# EAGLE schematic BSK5 (EAGLE 9.4.2)
ESKD_DESCRIPTION1: 207|235|224|242|224|32|193|209|202|53; ESKD_DESCRIPTION2: 241|245|229|236|224|32|253|235|229|234|242|240|232|247|229|241|234|224|255; ESKD_DESCRIPTION3: 239|240|232|237|246|232|239|232|224|235|252|237|224|255; ESKD_NUMBER: 67|67|83|50|46|50|54|48|48|45|48|221|51; ESKD_NUMBER_SHEET: 49; ESKD_SHEETS: 49
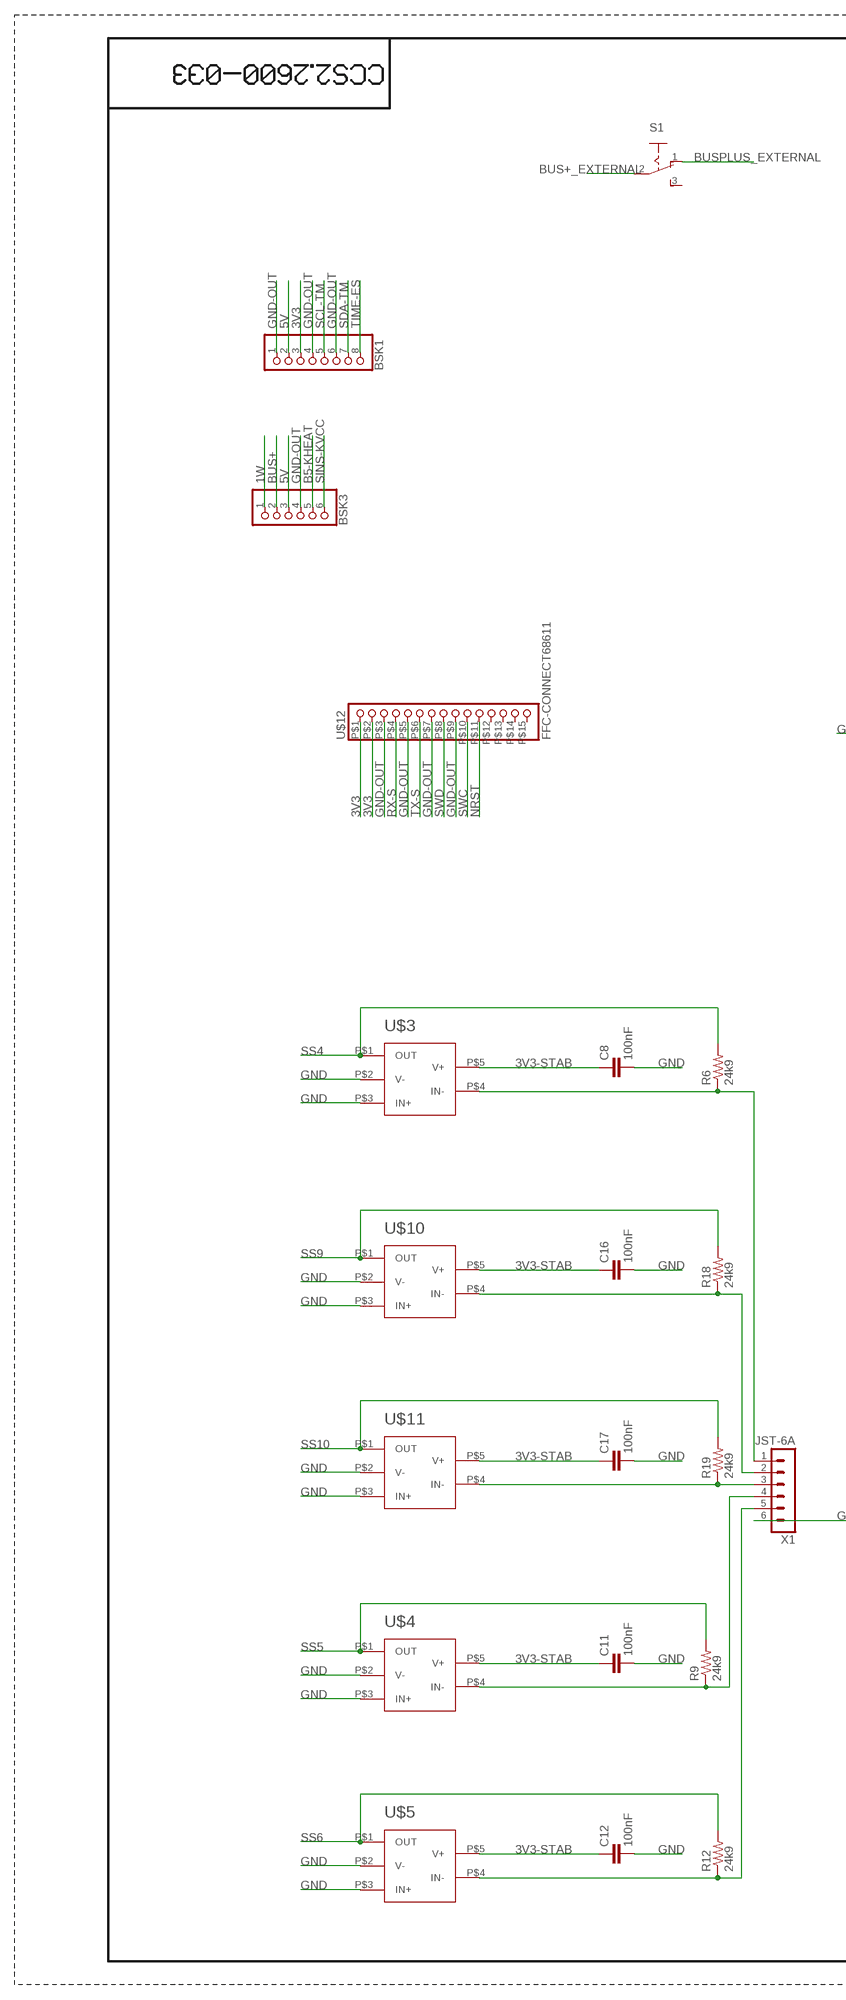
[diagram p0: schematic, sheet 1, part 1 of 3]
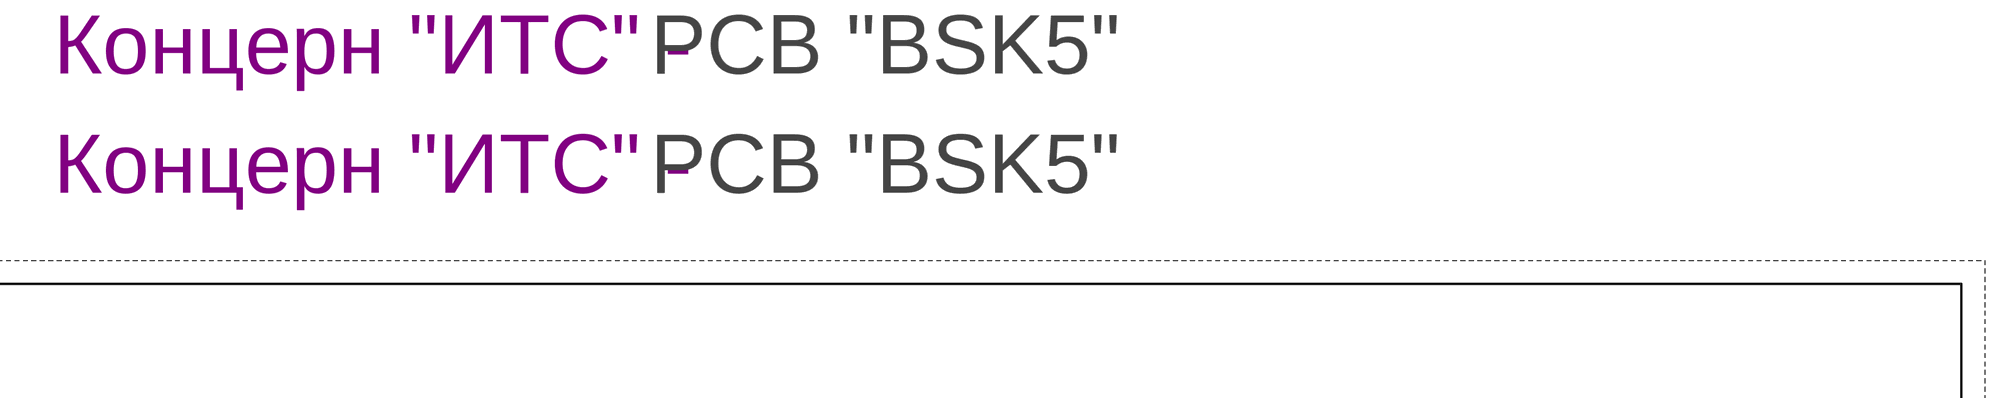
[diagram p1: schematic, sheet 1, part 2 of 3]
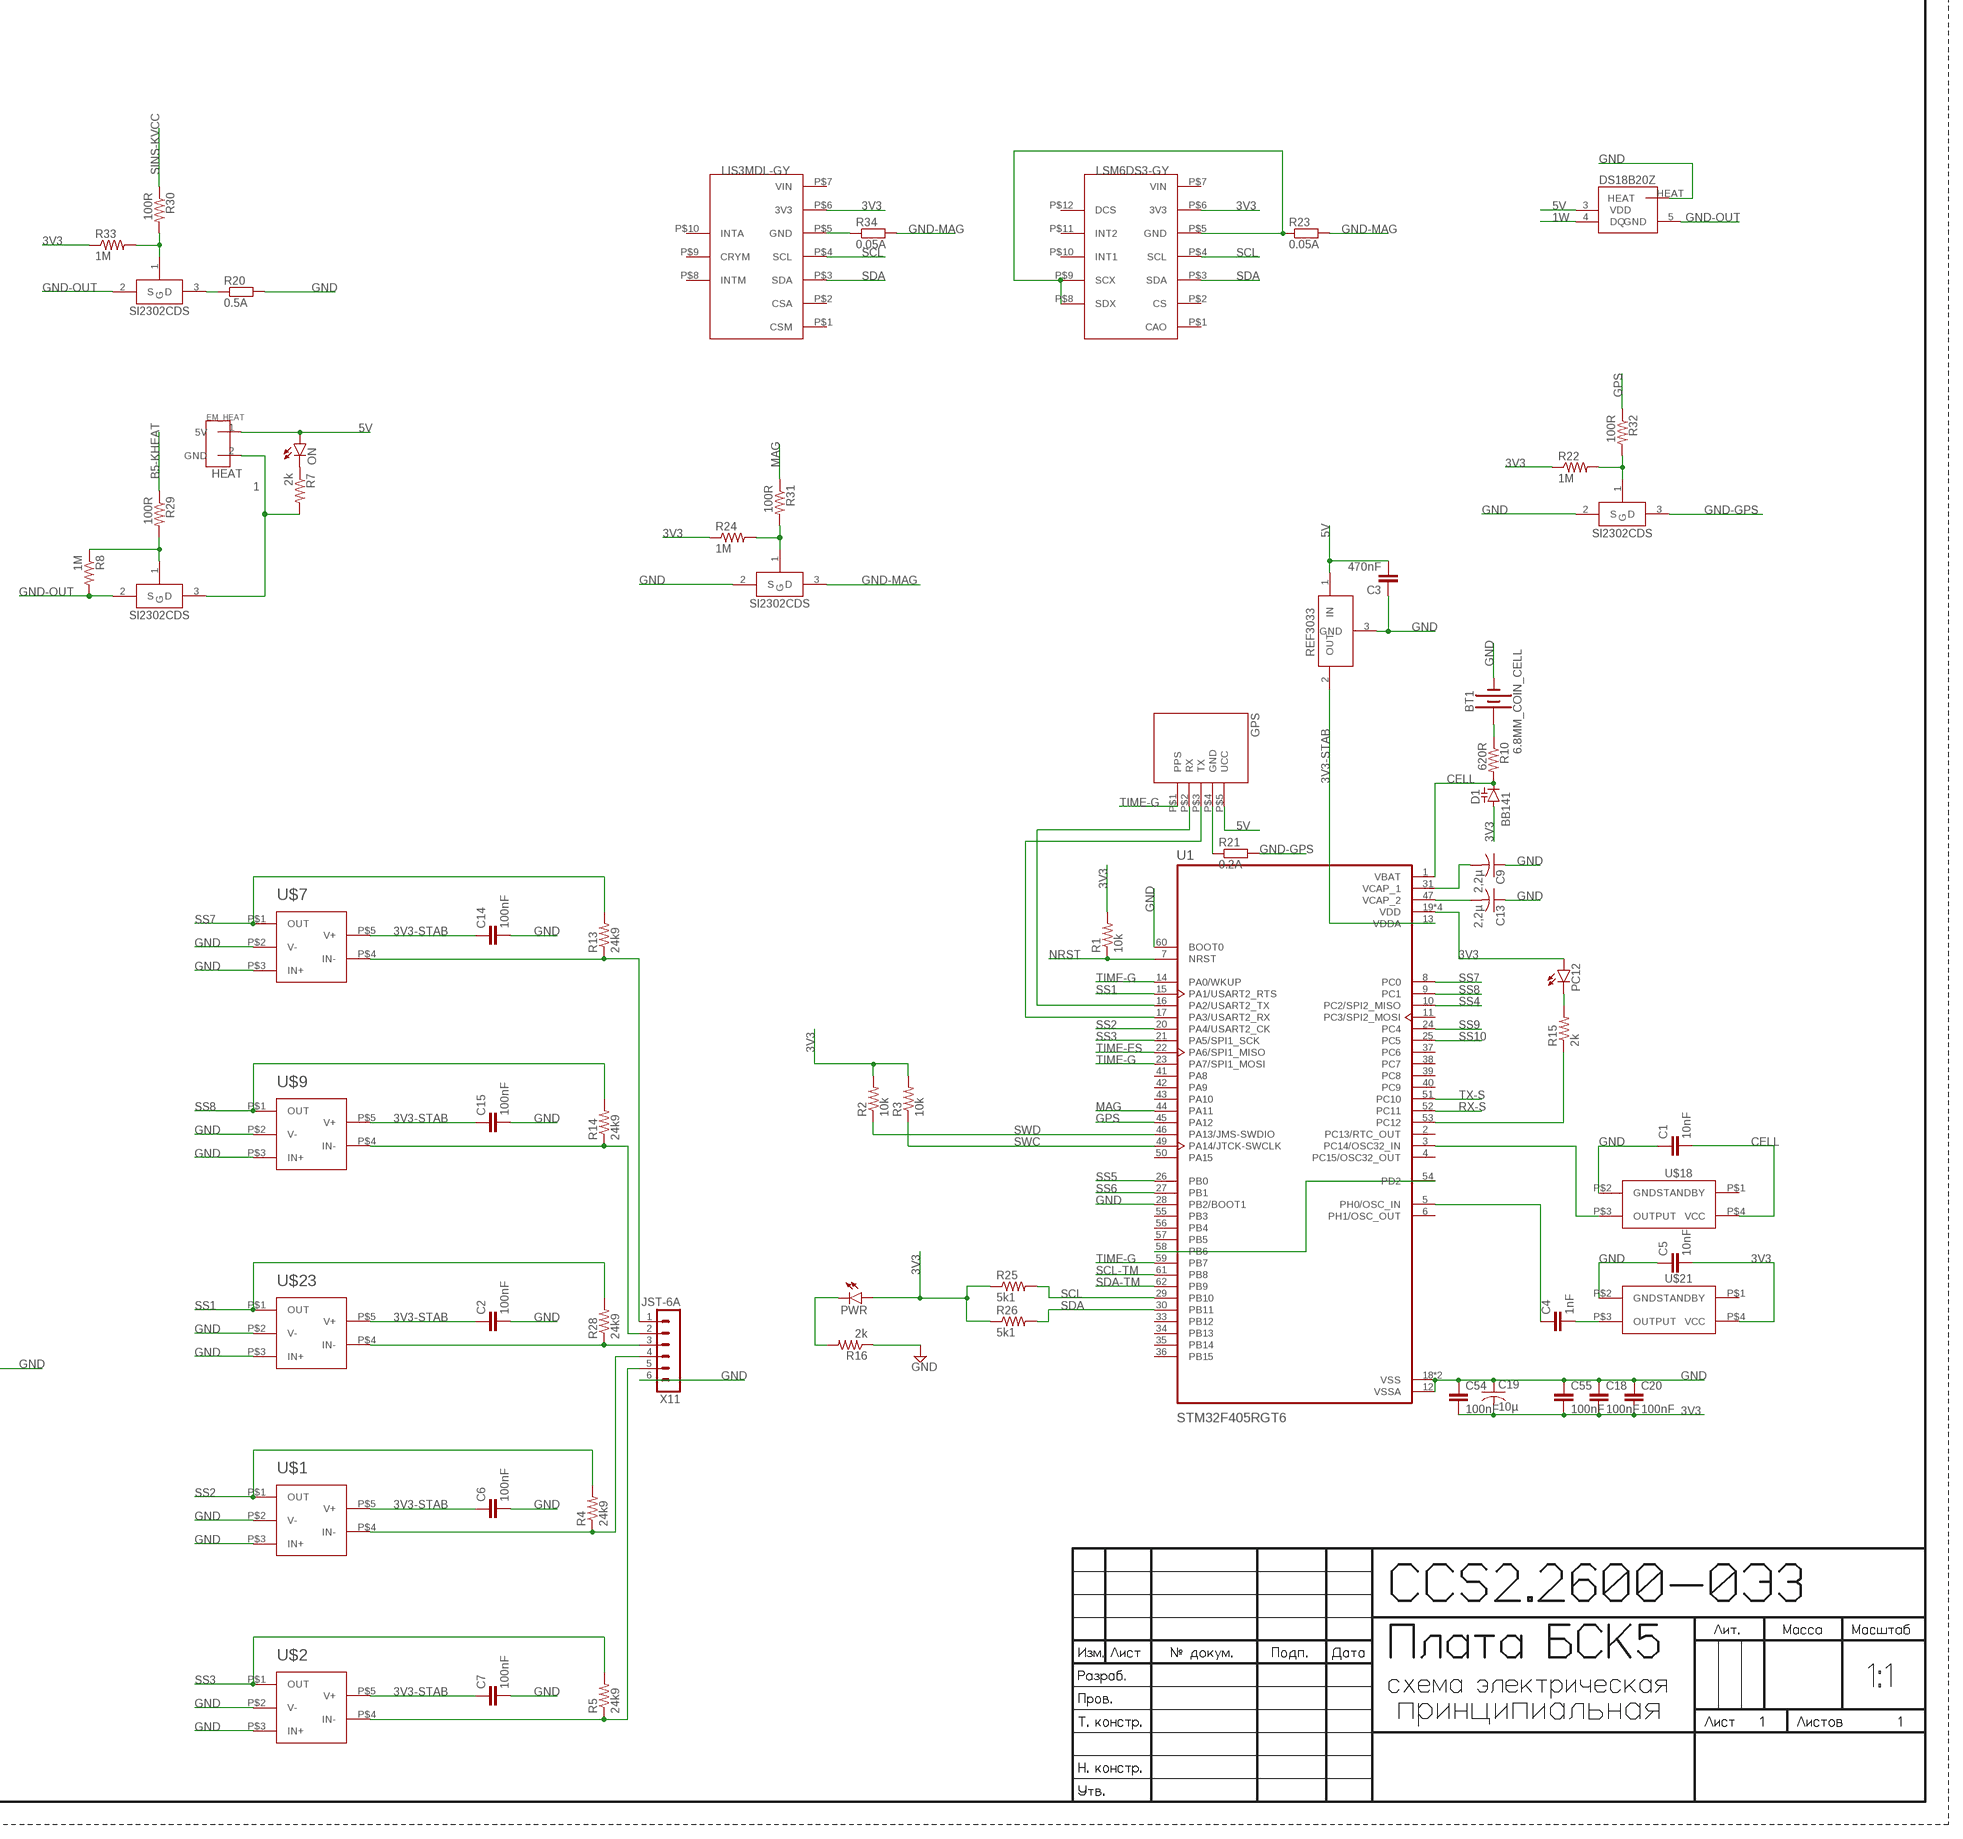
[diagram p2: schematic, sheet 1, part 3 of 3]

## Parts
BSK1  PINHD-1X8  [1X08]
BSK3  PINHD-1X6  [1X06]
BT1  6.8MM_COIN_CELL  BATTERY-6.8MM_SMD  [BATTCON-6.8MM]
C1  10nF  C-EUC0603  [C0603]
C2  100nF  C-EUC0603  [C0603]
C3  470nF  C-EUC0603  [C0603]
C4  1nF  C-EUC0603  [C0603]
C5  10nF  C-EUC0603  [C0603]
C6  100nF  C-EUC0603  [C0603]
C7  100nF  C-EUC0603  [C0603]
C8  100nF  C-EUC0603  [C0603]
C9  2,2µ  C-USC0603  [C0603]
C11  100nF  C-EUC0603  [C0603]
C12  100nF  C-EUC0603  [C0603]
C13  2,2µ  C-USC0603  [C0603]
C14  100nF  C-EUC0603  [C0603]
C15  100nF  C-EUC0603  [C0603]
C16  100nF  C-EUC0603  [C0603]
C17  100nF  C-EUC0603  [C0603]
C18  100nF  C-EUC0603  [C0603]
C19  10µ  C-USC1206  [C1206]
C20  100nF  C-EUC0603  [C0603]
C54  100nF  C-EUC0603  [C0603]
C55  100nF  C-EUC0603  [C0603]
D1  BB141  [SOD523]
DS18B20Z1  DS18B20Z  [SOIC8+HEAT_S]
GPS  GPSNEO6M  [GPS-NEO6M]
HEATER  EM_HEAT  [EM_HEAT]
LIS3MDL-GY  LIS3MDL-GY  [LIS3MDL-GY]
LSM6DS3-GY  LSM6DS3-GY  [LSM6DS3-GY]
ON  LEDCHIPLED_0603  [CHIPLED_0603]
PC12  LEDCHIPLED_0603  [CHIPLED_0603]
PWR  LEDCHIPLED_0603  [CHIPLED_0603]
R1  10k  R-US_R0603  [R0603]
R2  10k  R-US_R0603  [R0603]
R3  10k  R-US_R0603  [R0603]
R4  24k9  R-US_R0603  [R0603]
R5  24k9  R-US_R0603  [R0603]
R6  24k9  R-US_R0603  [R0603]
R7  2k  R-US_R0603  [R0603]
R8  1M  R-US_R0603  [R0603]
R9  24k9  R-US_R0603  [R0603]
R10  620R  R-US_R0603  [R0603]
R12  24k9  R-US_R0603  [R0603]
R13  24k9  R-US_R0603  [R0603]
R14  24k9  R-US_R0603  [R0603]
R15  2k  R-US_R0603  [R0603]
R16  2k  R-US_R0603  [R0603]
R18  24k9  R-US_R0603  [R0603]
R19  24k9  R-US_R0603  [R0603]
R20  0.5A  R-EU_R1210  [R1210]
R21  0.2A  R-EU_R1210  [R1210]
R22  1M  R-US_R0603  [R0603]
R23  0.05A  R-EU_R1210  [R1210]
R24  1M  R-US_R0603  [R0603]
R25  5k1  R-US_R0603  [R0603]
R26  5k1  R-US_R0603  [R0603]
R28  24k9  R-US_R0603  [R0603]
R29  100R  R-US_R0603  [R0603]
R30  100R  R-US_R0603  [R0603]
R31  100R  R-US_R0603  [R0603]
R32  100R  R-US_R0603  [R0603]
R33  1M  R-US_R0603  [R0603]
R34  0.05A  R-EU_R1210  [R1210]
S1  UNICS-SWITCH  [UNICS-SWITCH]
U1  STM32F405RGT6  [QFP50P1200X1200X160-64N]
U$1  LMC7101  [LMC7101]
U$2  LMC7101  [LMC7101]
U$3  LMC7101  [LMC7101]
U$4  LMC7101  [LMC7101]
U$5  LMC7101  [LMC7101]
U$6  REF3033  [SOT23-3]
U$7  LMC7101  [LMC7101]
U$8  SI2302CDS  [SOT23-3]
U$9  LMC7101  [LMC7101]
U$10  LMC7101  [LMC7101]
U$11  LMC7101  [LMC7101]
U$12  FFC-CONNECT68611  [68611]
U$13  PCB "BSK5"  ITS-LOGOPCB-""  [ITS-LOGO]
U$18  Q32.768  [Q32.768]
U$19  SI2302CDS  [SOT23-3]
U$20  SI2302CDS  [SOT23-3]
U$21  Q24  [Q24]
U$22  SI2302CDS  [SOT23-3]
U$23  LMC7101  [LMC7101]
U$26  PCB "BSK5"  ITS-LOGOPCB-""  [ITS-LOGO]
X1  JST-6A  [B6B-EH-A]
X11  JST-6A  [B6B-EH-A]

## Nets
1: HEATER.2(GND) R7.2 U$8.3(D)
1W: BSK3.1 DS18B20Z1.4(DQ)
3V3: BSK1.3 C5.2 C18.2 C19.2 C20.2 C54.2 C55.2 D1.A LIS3MDL-GY.P$6(3V3) LSM6DS3-GY.P$6(3V3) PC12.A PWR.A R1.2 R2.2 R3.2 R22.1 R24.1 R25.1 R26.1 R33.1 U1.19(VDD) U1.32(VDD) U1.48(VDD) U1.64(VDD) U$12.P$1 U$12.P$2 U$21.P$4(VCC)
3V3-STAB: C2.1 C6.1 C7.1 C8.1 C11.1 C12.1 C14.1 C15.1 C16.1 C17.1 U1.13(VDDA) U$1.P$5(V+) U$2.P$5(V+) U$3.P$5(V+) U$4.P$5(V+) U$5.P$5(V+) U$6.2(OUT) U$7.P$5(V+) U$9.P$5(V+) U$10.P$5(V+) U$11.P$5(V+) U$23.P$5(V+)
5V: BSK1.2 BSK3.3 C3.2 DS18B20Z1.3(VDD) GPS.P$5(UCC) HEATER.1(5V) ON.A U$6.1(IN)
B5-KHEAT: BSK3.5 R29.1
BUS+: BSK3.2
BUS+_EXTERNAL: S1.2(P)
BUSPLUS_EXTERNAL: S1.1(O)
CELL: C1.2 D1.C R10.2 U1.1(VBAT) U$18.P$4(VCC)
GND: BT1.- C1.1 C2.2 C3.1 C5.1 C6.2 C7.2 C8.2 C9.1 C11.2 C12.2 C13.1 C14.2 C15.2 C16.2 C17.2 C18.1 C19.1 C20.1 C54.1 C55.1 DS18B20Z1.HEAT R16.1 R20.2 U1.12(VSSA) U1.18(VSS) U1.28(PB2/BOOT1) U1.60(BOOT0) U1.63(VSS) U$1.P$2(V-) U$1.P$3(IN+) U$2.P$2(V-) U$2.P$3(IN+) U$3.P$2(V-) U$3.P$3(IN+) U$4.P$2(V-) U$4.P$3(IN+) U$5.P$2(V-) U$5.P$3(IN+) U$6.3(GND) U$7.P$2(V-) U$7.P$3(IN+) U$9.P$2(V-) U$9.P$3(IN+) U$10.P$2(V-) U$10.P$3(IN+) U$11.P$2(V-) U$11.P$3(IN+) U$18.P$2(GND) U$19.2(S) U$20.2(S) U$21.P$2(GND) U$23.P$2(V-) U$23.P$3(IN+) X1.6 X11.6
GND-GPS: R21.2 U$20.3(D)
GND-MAG: R23.2 R34.2 U$19.3(D)
GND-OUT: BSK1.1 BSK1.4 BSK1.6 BSK3.4 DS18B20Z1.5(GND) R8.2 U$8.2(S) U$12.P$3 U$12.P$5 U$12.P$7 U$12.P$9 U$22.2(S)
GPS: R32.1 U1.45(PA12)
MAG: R31.1 U1.44(PA11)
N$1: U1.3(PC14/OSC32_IN) U$18.P$3(OUTPUT)
N$2: R20.1 U$22.3(D)
N$4: R13.1 U$7.P$4(IN-) X11.1
N$5: R6.1 U$3.P$4(IN-) X1.1
N$6: R9.1 U$4.P$4(IN-) X1.4
N$7: R8.1 R29.2 U$8.1(G)
N$10: R30.2 R33.2 U$22.1(G)
N$11: R24.2 R31.2 U$19.1(G)
N$12: LSM6DS3-GY.P$5(GND) LSM6DS3-GY.P$8(SDX) LSM6DS3-GY.P$9(SCX) R23.1
N$13: R22.2 R32.2 U$20.1(G)
N$14: LIS3MDL-GY.P$5(GND) R34.1
N$26: BT1.+ R10.1
N$27: GPS.P$4(GND) R21.1
N$28: U1.54(PD2) U1.58(PB6)
N$29: C13.2 U1.47(VCAP_2)
N$30: R4.1 U$1.P$4(IN-) X11.4
N$31: R5.1 U$2.P$4(IN-) X11.5
N$33: ON.C R7.1
N$35: R12.1 U$5.P$4(IN-) X1.5
N$36: C9.2 U1.31(VCAP_1)
N$37: PC12.C R15.2
N$38: R15.1 U1.53(PC12)
N$40: PWR.C R16.2
N$41: GPS.P$2(RX) U1.16(PA2/USART2_TX)
N$42: GPS.P$3(TX) U1.17(PA3/USART2_RX)
N$43: C4.2 U$21.P$3(OUTPUT)
N$44: C4.1 U1.5(PH0/OSC_IN)
N$45: R28.1 U$23.P$4(IN-) X11.3
N$46: R14.1 U$9.P$4(IN-) X11.2
N$47: R18.1 U$10.P$4(IN-) X1.2
N$48: R19.1 U$11.P$4(IN-) X1.3
NRST: R1.1 U1.7(NRST) U$12.P$11
RX-S: U1.52(PC11) U$12.P$4
SCL: LIS3MDL-GY.P$4(SCL) LSM6DS3-GY.P$4(SCL) R25.2 U1.29(PB10)
SCL-TM: BSK1.5 U1.61(PB8)
SDA: LIS3MDL-GY.P$3(SDA) LSM6DS3-GY.P$3(SDA) R26.2 U1.30(PB11)
SDA-TM: BSK1.7 U1.62(PB9)
SINS-KVCC: BSK3.6 R30.1
SS1: R28.2 U1.15(PA1/USART2_RTS) U$23.P$1(OUT)
SS2: R4.2 U1.20(PA4/USART2_CK) U$1.P$1(OUT)
SS3: R5.2 U1.21(PA5/SPI1_SCK) U$2.P$1(OUT)
SS4: R6.2 U1.10(PC2/SPI2_MISO) U$3.P$1(OUT)
SS5: R9.2 U1.26(PB0) U$4.P$1(OUT)
SS6: R12.2 U1.27(PB1) U$5.P$1(OUT)
SS7: R13.2 U1.8(PC0) U$7.P$1(OUT)
SS8: R14.2 U1.9(PC1) U$9.P$1(OUT)
SS9: R18.2 U1.24(PC4) U$10.P$1(OUT)
SS10: R19.2 U1.25(PC5) U$11.P$1(OUT)
SWC: R3.1 U1.49(PA14/JTCK-SWCLK) U$12.P$10
SWD: R2.1 U1.46(PA13/JMS-SWDIO) U$12.P$8
TIME-ES: BSK1.8 U1.22(PA6/SPI1_MISO)
TIME-G: GPS.P$1(PPS) U1.14(PA0/WKUP) U1.23(PA7/SPI1_MOSI) U1.59(PB7)
TX-S: U1.51(PC10) U$12.P$6
Unconnected: LIS3MDL-GY.P$1(CSM) LIS3MDL-GY.P$2(CSA) LIS3MDL-GY.P$7(VIN) LIS3MDL-GY.P$8(INTM) LIS3MDL-GY.P$9(CRYM) LIS3MDL-GY.P$10(INTA) LSM6DS3-GY.P$1(CAO) LSM6DS3-GY.P$2(CS) LSM6DS3-GY.P$7(VIN) LSM6DS3-GY.P$10(INT1) LSM6DS3-GY.P$11(INT2) LSM6DS3-GY.P$12(DCS) S1.3(S) U1.2(PC13/RTC_OUT) U1.4(PC15/OSC32_OUT) U1.6(PH1/OSC_OUT) U1.11(PC3/SPI2_MOSI) U1.33(PB12) U1.34(PB13) U1.35(PB14) U1.36(PB15) U1.37(PC6) U1.38(PC7) U1.39(PC8) U1.40(PC9) U1.41(PA8) U1.42(PA9) U1.43(PA10) U1.50(PA15) U1.55(PB3) U1.56(PB4) U1.57(PB5) U$12.P$12 U$12.P$13 U$12.P$14 U$12.P$15 U$18.P$1(STANDBY) U$21.P$1(STANDBY)

## Notes on the sheet
- HEAT

## Library data of the parts
BSK1 = pinheadCS:PINHD-1X8: PIN HEADER
BSK3 = pinheadCS:PINHD-1X6: PIN HEADER
BT1 = SparkFun-Batteries:BATTERY: Battery - Single Cell A variety of battery chemistries, sizes, and footprints. Device List: 20MM_PTH - Coin Cell Battery Holder - 20mm (PTH) <https://www.sparkfun.com/products/783> 20MM_PTH_KIT- Coin Cell battery Holder - 20 mm (PTH) <http://www.sparkfun.com/products/783>kit version with special mask 6.8MM_PTH - Coin Cell Battery Holder - 6.8MM(SMD) <https://www.digikey.com/product-detail/en/seiko-instruments/MS621FE-FL11E/728-1057-ND/1889208?WT.srch=1&gclid=CNOQ5a6LzdQCFZS2wAodXCkE0g> 12MM_SMD - Coin Cell Battery Holder - 12mm (SMD) <https://www.sparkfun.com/products/10592> 12MM_PTH - Coin Cell Battery Holder - 12mm (PTH) <https://www.sparkfun.com/products/7948> 20MM_SMD - 20mm Coin Cell Battery Holder (SMD) (2 legs) Used on the Big Time Watch Kit <https://www.sparkfun.com/products/11734> 20MM_SMD_4LEGS - Coin Cell Battery Holder - 20mm (SMD) <https://www.sparkfun.com/products/11892> 20MM_SMD_4LEGS_OVERPASTE - Coin Cell Battery Holder - 20mm (SMD) <https://www.sparkfun.com/products/11892> (Over-paste on the legs) 24.5MM_PTH - Coin Cell Battery Holder - 24.5mm (PTH) <https://www.sparkfun.com/products/8863> 9V - 9V Battery Holder - PC Mount Used on the SparkFun SparkPunk Sound Kit <https://www.sparkfun.com/products/11177> and SparkFun SparkPunk Sequencer Kit <https://www.sparkfun.com/products/12707> 18650 - Battery Holder - 18650 (PTH) <https://www.sparkfun.com/products/13113> AA - Battery Holder - 1xAA (PTH) <https://www.sparkfun.com/products/7949> AAA - Battery Holder - 1xAAA (PTH) <https://www.sparkfun.com/products/12718> AA_KIT - Battery Holder - 1xAA (PTH) <https://www.sparkfun.com/products/7949> Special kit package - pads only have exposed copper on one side of the board. AAA_KIT - Battery Holder - 1xAAA (PTH) <https://www.sparkfun.com/products/12718> Special kit package - pads only have exposed copper on one side of the board.; PROD_ID: BATT-13734
C1-C8 C11 C12 C14-C18 C20 C54 C55 = rcl:C-EU: CAPACITOR, European symbol; SPICEPREFIX: C
C9 C13 C19 = rcl:C-US: CAPACITOR, American symbol; SPICEPREFIX: C
D1 = diode:BB141: Capacity DIODE variable-capacitance diode
DS18B20Z1 = CanCubeSat:DS18B20Z
GPS = CanCubeSat:GPS
HEATER = CanCubeSat:EM_HEAT
LIS3MDL-GY = CanCubeSat:LIS3MDL-GY
LSM6DS3-GY = CanCubeSat:LSM6DS3-GY
ON PC12 PWR = led:LED: LED OSRAM: - CHIPLED LG R971, LG N971, LY N971, LG Q971, LY Q971, LO R971, LY R971 LH N974, LH R974 LS Q976, LO Q976, LY Q976 LO Q996 - Hyper CHIPLED LW Q18S LB Q993, LB Q99A, LB R99A - SideLED LS A670, LO A670, LY A670, LG A670, LP A670 LB A673, LV A673, LT A673, LW A673 LH A674 LY A675 LS A676, LA A676, LO A676, LY A676, LW A676 LS A679, LY A679, LG A679 - Hyper Micro SIDELED® LS Y876, LA Y876, LO Y876, LY Y876 LT Y87S - SmartLED LW L88C, LW L88S LB L89C, LB L89S, LG L890 LS L89K, LO L89K, LY L89K LS L896, LA L896, LO L896, LY L896 - TOPLED LS T670, LO T670, LY T670, LG T670, LP T670 LSG T670, LSP T670, LSY T670, LOP T670, LYG T670 LG T671, LOG T671, LSG T671 LB T673, LV T673, LT T673, LW T673 LH T674 LS T676, LA T676, LO T676, LY T676, LB T676, LH T676, LSB T676, LW T676 LB T67C, LV T67C, LT T67C, LS T67K, LO T67K, LY T67K, LW E67C LS E67B, LA E67B, LO E67B, LY E67B, LB E67C, LV E67C, LT E67C LW T67C LS T679, LY T679, LG T679 LS T770, LO T770, LY T770, LG T770, LP T770 LB T773, LV T773, LT T773, LW T773 LH T774 LS E675, LA E675, LY E675, LS T675 LS T776, LA T776, LO T776, LY T776, LB T776 LHGB T686 LT T68C, LB T68C - Hyper Mini TOPLED® LB M676 - Mini TOPLED Santana® LG M470 LS M47K, LO M47K, LY M47K Source: http://www.osram.convergy.de LUXEON: - LUMILED® LXK2-PW12-R00, LXK2-PW12-S00, LXK2-PW14-U00, LXK2-PW14-V00 LXK2-PM12-R00, LXK2-PM12-S00, LXK2-PM14-U00 LXK2-PE12-Q00, LXK2-PE12-R00, LXK2-PE12-S00, LXK2-PE14-T00, LXK2-PE14-U00 LXK2-PB12-K00, LXK2-PB12-L00, LXK2-PB12-M00, LXK2-PB14-N00, LXK2-PB14-P00, LXK2-PB14-Q00 LXK2-PR12-L00, LXK2-PR12-M00, LXK2-PR14-Q00, LXK2-PR14-R00 LXK2-PD12-Q00, LXK2-PD12-R00, LXK2-PD12-S00 LXK2-PH12-R00, LXK2-PH12-S00 LXK2-PL12-P00, LXK2-PL12-Q00, LXK2-PL12-R00 Source: www.luxeon.com KINGBRIGHT: KA-3528ASYC Source: www.kingbright.com
R1-R10 R12-R16 R18 R19 R22 R24-R26 R28-R33 = resistor:R-US_: RESISTOR, American symbol
R20 R21 R23 R34 = rcl:R-EU_: RESISTOR, European symbol; SPICEPREFIX: R
S1 = cansat-lib:UNICS-SWITCH: SLIDING SWITCH Distributor Buerklin, 11G810
U1 = STM32F405RGT6:STM32F405RGT6: High-performance foundation line, ARM Cortex-M4 core with DSP and FPU, 1 Mbyte Flash, 168 MHz CPU, ART Accelerator; DESCRIPTION: High-performance foundation line, ARM Cortex-M4 core with DSP and FPU, 1 Mbyte Flash, 168 MHz CPU, ART Accelerator; DIGI-KEY_PART_NUMBER: 497-11767-ND; DIGI-KEY_PURCHASE_URL: https://www.digikey.com/product-detail/en/stmicroelectronics/STM32F405RGT6/497-11767-ND/2754208?utm_source=snapeda&utm_medium=aggregator&utm_campaign=symbol; MF: STMicroelectronics; MP: STM32F405RGT6; PACKAGE: LQFP-64 STMicroelectronics
U$1-U$5 U$7 U$9-U$11 U$23 = CanCubeSat:LMC7101
U$6 = CanCubeSat:REF3033
U$8 U$19 U$20 U$22 = CanCubeSat:SI2302CDS
U$12 = CanCubeSat:FFC-CONNECT
U$13 U$26 = CanCubeSat:ITS-LOGO
U$18 = CanCubeSat:Q32.768
U$21 = CanCubeSat:Q24
X1 X11 = CanCubeSat:JST-6: JST PH series header 2.00mm pitch disconnectable crimp style connectors, vertical (side entry type), 6 pins